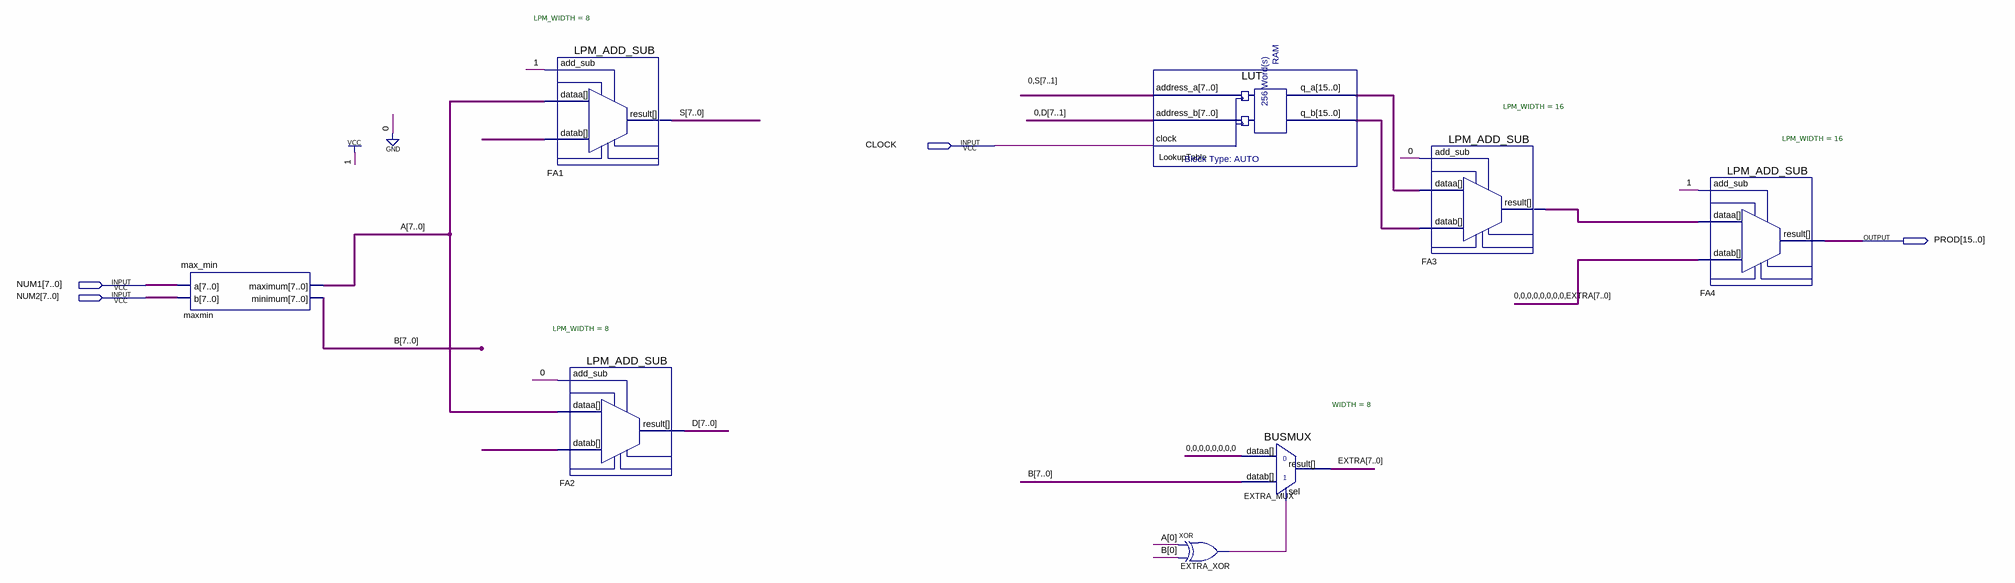
[diagram p0: schematic sheet]
// Quartus schematic mul8.bdf as structural Verilog: 8 symbols, 4 pins
module mul8 (
  input  CLOCK,
  input  [7:0] NUM1,
  input  [7:0] NUM2,
  output [15:0] PROD
);

  wire EXTRA_XOR_out;
  wire [7:0] A, B, D, EXTRA, S, undriven, undriven_2;
  wire [15:0] FA3_result, LookupTable_q_a, LookupTable_q_b;

  max_min maxmin (.a(NUM1), .b(NUM2), .maximum(A), .minimum(B));
  LPM_ADD_SUB #(.LPM_WIDTH(8)) FA1 (.add_sub(1'b1), .dataa(A), .datab(undriven), .result(S));
  LPM_ADD_SUB #(.LPM_WIDTH(8)) FA2 (.add_sub(1'b0), .dataa(A), .datab(undriven_2), .result(D));
  LUT LookupTable (
    .address_a({1'b0, S[7:1]}), .address_b({1'b0, D[7:1]}), .clock(CLOCK), .q_a(LookupTable_q_a),
    .q_b(LookupTable_q_b));
  xor EXTRA_XOR (EXTRA_XOR_out, A[0], B[0]);
  BUSMUX #(.WIDTH(8)) EXTRA_MUX (.datab(B), .sel(EXTRA_XOR_out), .dataa({8{1'b0}}), .result(EXTRA));
  LPM_ADD_SUB #(.LPM_WIDTH(16)) FA3 (
    .add_sub(1'b0), .dataa(LookupTable_q_a), .datab(LookupTable_q_b), .result(FA3_result));
  LPM_ADD_SUB #(.LPM_WIDTH(16)) FA4 (.add_sub(1'b1), .dataa(FA3_result), .datab({{8{1'b0}}, EXTRA}), .result(PROD));
endmodule
